# Altium schematic sheet MFX.SchDoc: MFX
size A4; DocumentNumber: MB1246; Revision: B.1; SheetNumber: 16; SheetTotal: 17; Project: STM32H7xxI-EVAL
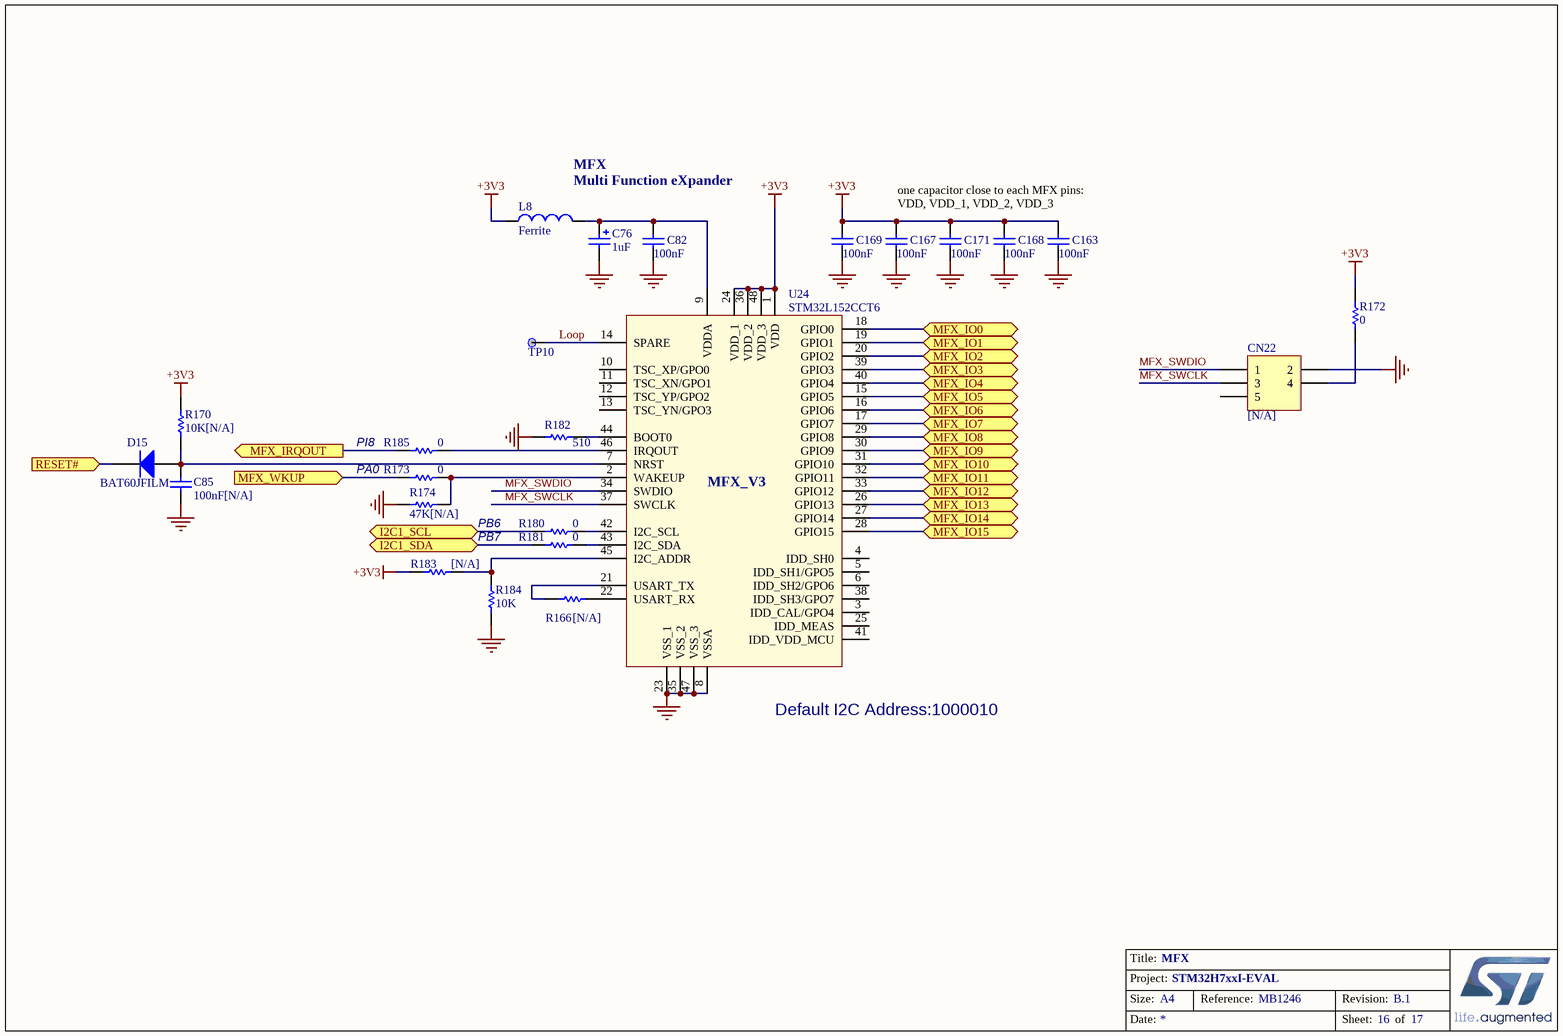
[diagram p0: MFX.SchDoc]

## Parts
C76  1uF  [TAN-A]
C82  100nF  [0402C]
C85  100nF[N/A]  [0402C]
C163  100nF  [0402C]
C167  100nF  [0402C]
C168  100nF  [0402C]
C169  100nF  [0402C]
C171  100nF  [0402C]
CN22  [N/A]  [HDR_2X3-1_2R54-6]
D15  BAT60JFILM  [SOD-323]
L8  Ferrite  [0603L]
R166  [N/A]  [0603R]
R170  10K[N/A]  [0402R]
R172  0  [0603R]
R173  0  [0603R]
R174  47K[N/A]  [0402R]
R180  0  [0603R]
R181  0  [0603R]
R182  510  [0402R]
R183  [N/A]  [0603R]
R184  10K  [0402R]
R185  0  [0603R]
TP10  (no value)  [TP]
U24  STM32L152CCT6  [LQFP48_0R5_9X9]

## Ports
I2C1_SCL (bidir), I2C1_SDA (bidir), MFX_IO0 (bidir), MFX_IO1 (bidir), MFX_IO2 (bidir), MFX_IO3 (bidir), MFX_IO4 (bidir), MFX_IO5 (bidir), MFX_IO6 (bidir), MFX_IO7 (bidir), MFX_IO8 (bidir), MFX_IO9 (bidir), MFX_IO10 (bidir), MFX_IO11 (bidir), MFX_IO12 (bidir), MFX_IO13 (bidir), MFX_IO14 (bidir), MFX_IO15 (bidir), MFX_IRQOUT (out), MFX_WKUP (in), RESET# (in)

## Nets
+3V3: C163.2 C167.2 C168.2 C169.2 C171.1 L8.1 R170.2 R172.1 R183.2 U24.1(VDD) U24.24(VDD_1) U24.36(VDD_2) U24.48(VDD_3)
GND: C76.2 C82.1 C85.1 C163.1 C167.1 C168.1 C169.1 C171.2 CN22.2 R174.1 R182.2 R184.2 U24.8(VSSA) U24.23(VSS_1) U24.35(VSS_2) U24.47(VSS_3)
I2C1_SCL: R180.1 ; port I2C1_SCL
I2C1_SDA: R181.1 ; port I2C1_SDA
Loop: TP10.1 U24.14(SPARE)
MFX_IO0: U24.18(GPIO0) ; port MFX_IO0
MFX_IO1: U24.19(GPIO1) ; port MFX_IO1
MFX_IO2: U24.20(GPIO2) ; port MFX_IO2
MFX_IO3: U24.39(GPIO3) ; port MFX_IO3
MFX_IO4: U24.40(GPIO4) ; port MFX_IO4
MFX_IO5: U24.15(GPIO5) ; port MFX_IO5
MFX_IO6: U24.16(GPIO6) ; port MFX_IO6
MFX_IO7: U24.17(GPIO7) ; port MFX_IO7
MFX_IO8: U24.29(GPIO8) ; port MFX_IO8
MFX_IO9: U24.30(GPIO9) ; port MFX_IO9
MFX_IO10: U24.31(GPIO10) ; port MFX_IO10
MFX_IO11: U24.32(GPIO11) ; port MFX_IO11
MFX_IO12: U24.33(GPIO12) ; port MFX_IO12
MFX_IO13: U24.26(GPIO13) ; port MFX_IO13
MFX_IO14: U24.27(GPIO14) ; port MFX_IO14
MFX_IO15: U24.28(GPIO15) ; port MFX_IO15
MFX_IRQOUT: R185.1 ; port MFX_IRQOUT
MFX_SWCLK: CN22.3 U24.37(SWCLK)
MFX_SWDIO: CN22.1 U24.34(SWDIO)
MFX_WKUP: R173.2 ; port MFX_WKUP
RESET#: D15.2(K) ; port RESET#
NetC76_1: C76.1 C82.2 L8.2 U24.9(VDDA)
NetC85_2: C85.2 D15.1(A) R170.1 U24.7(NRST)
NetCN22_4: CN22.4 R172.2
NetR166_1: R166.1 U24.21(USART_TX)
NetR166_2: R166.2 U24.22(USART_RX)
NetR173_1: R173.1 R174.2 U24.2(WAKEUP)
NetR180_2: R180.2 U24.42(I2C_SCL)
NetR181_2: R181.2 U24.43(I2C_SDA)
NetR182_1: R182.1 U24.44(BOOT0)
NetR183_1: R183.1 R184.1 U24.45(I2C_ADDR)
NetR185_2: R185.2 U24.46(IRQOUT)

Not connected (* = marked no-connect by the designer): CN22 5; U24 3(IDD_CAL/GPO4) 4(IDD_SH0) 5(IDD_SH1/GPO5) 6(IDD_SH2/GPO6) 10(TSC_XP/GPO0) 11(TSC_XN/GPO1) 12(TSC_YP/GPO2) 13(TSC_YN/GPO3) 25(IDD_MEAS) 38(IDD_SH3/GPO7) 41(IDD_VDD_MCU)

## Notes on the sheet
- MFX
  Multi Function eXpander
- one capacitor close to each MFX pins: VDD, VDD_1, VDD_2, VDD_3
- PI8
- PA0
- PB6
- PB7
- (near U24) Default I2C Address:1000010
- Title:
- Project:
- Size:
- Date:
- A4
- Reference:
- Sheet:
- Revision:
- of
- (in symbol MFX) MFX_V3

## Library data of the parts
C76 = Cap_1uF_POL_10%_TANA: Polarized Capacitor,1uF,16V,10%,typeA,AVX; Manuf_Part_1: TAJA105K016R; Revision: July-2002: Re-released for DXP Platform.; Value: 1uF; Order: TAJA105K016R; Manuf_1: AVX; Distrib: *
C82 C85 C163 C167-C169 C171 = Cap_100nF_X7R_10%_0402: Capacitor,100nF,16V,X7R,10%,0402,YAGEO; Manuf_Part_1: CC0402KRX7R7BB104; Revision: July-2002: Re-released for DXP Platform.; Value: 100nF; Order: CC0402KRX7R7BB104; Manuf_1: YAGEO
CN22 = Header 3X2: Header, 3-Pin, Dual row; Revision: 17-Jul-2002: Re-released for DXP Platform.; Publisher: Altium Limited
D15 = Diode: Default Diode; Code - JEDEC: DO-214-AB; Published: 8-Jun-2000; Revision: July-2002: Re-released for DXP Platform.; Publisher: Altium Limited
L8 = BEAD_600R_350MA_0603: Bead,600R,350mA,0603,FCM1608KF-601T03,Tai-tech; Manuf_2: TDK; Manuf_Part_2: MPZ1608S300A; Value: 100uH; Comment_1: bead,30R,5A,0603,MPZ1608S300A,TDK; Revision: July-2002: Re-released for DXP Platform.; Manuf_Part_1: FCM1608KF-601T03; Order: FCM1608KF-601T03; Manuf_1: Tai-tech
R166 = res1: Resistor; Value: 1K; Ordered by: Subcon; Published: 8-Jun-2000; Revision: July-2002: Re-released for DXP Platform.; Publisher: Altium Limited
R170 R174 R182 = Resistor_ST: Resistor 0402 / 0603 / 0805; Description: Resistor 0402 or 0603 or 0805; Value: 10K
R172 R180 R181 R185 = Res1: Resistor; Value: 1K; Ordered by: Subcon; Published: 8-Jun-2000; Revision: July-2002: Re-released for DXP Platform.; Publisher: Altium Limited
R173 R183 = Res1: Resistor; Value: 1K; Published: 8-Jun-2000; Revision: July-2002: Re-released for DXP Platform.; Publisher: Altium Limited
R184 = Resistor_ST: Resistor 0402 / 0603 / 0805; Description: Resistor 0402 or 0603 or 0805; Value: 10K
TP10 = TP
U24 = MFX: Multifunction expander